# Altium schematic sheet IdealDiode.SchDoc
size A
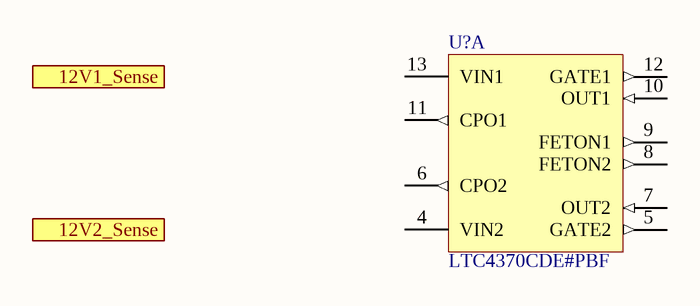
[diagram p0: IdealDiode.SchDoc]

## Parts
U?  LTC4370CDE#PBF  [LT-DE-16_V]  (part A of 2)

## Ports
12V1_Sense (in), 12V2_Sense (in)

## Nets

Not connected (* = marked no-connect by the designer): U? 4(VIN2) 5(GATE2) 6(CPO2) 7(OUT2) 8(FETON2) 9(FETON1) 10(OUT1) 11(CPO1) 12(GATE1) 13(VIN1)

## Library data of the parts
U? = CMP-0479-00068-1: Two-Supply Diode-OR Current Balancing Controller, 0 to 18 V Vin, 16-pin SON (DE-16), 0 to 70 degC, Pb-Free; Manufacturer: Linear Technology; Ideal Diode: Dual, External, N-Channel; PackageReference: DE-16; PartNumber: LTC4370CDE#PBF; ComponentLink3URL: http://cds.linear.com/docs/en/packaging/DFN_16_05-08-1732.pdf; Code_JEDEC: MO-229; ComponentLink2URL: http://cds.linear.com/docs/en/datasheet/4370f.pdf; ComponentLink1URL: http://www.linear.com/; Mounting Technology: Surface Mount; ComponentLink2Description: Datasheet; ComponentLink1Description: Manufacturer URL; PackageVersion: Rev. Ã˜, 06/2010; RoHS: TRUE; ComponentLink3Description: Package Specification; PackageDescription: 16-Pin Plastic DFN, Body 4 x 3 mm, Pitch 0.45 mm